# EasyEDA schematic SCH_Pcb Tof Robocup Joaquin_2023-06-20.json
TITLE: Sheet_1; REV: 1.0; Date: 2023-05-25; Sheet: 1/1; Drawn By: omglocura; Company: Your Company
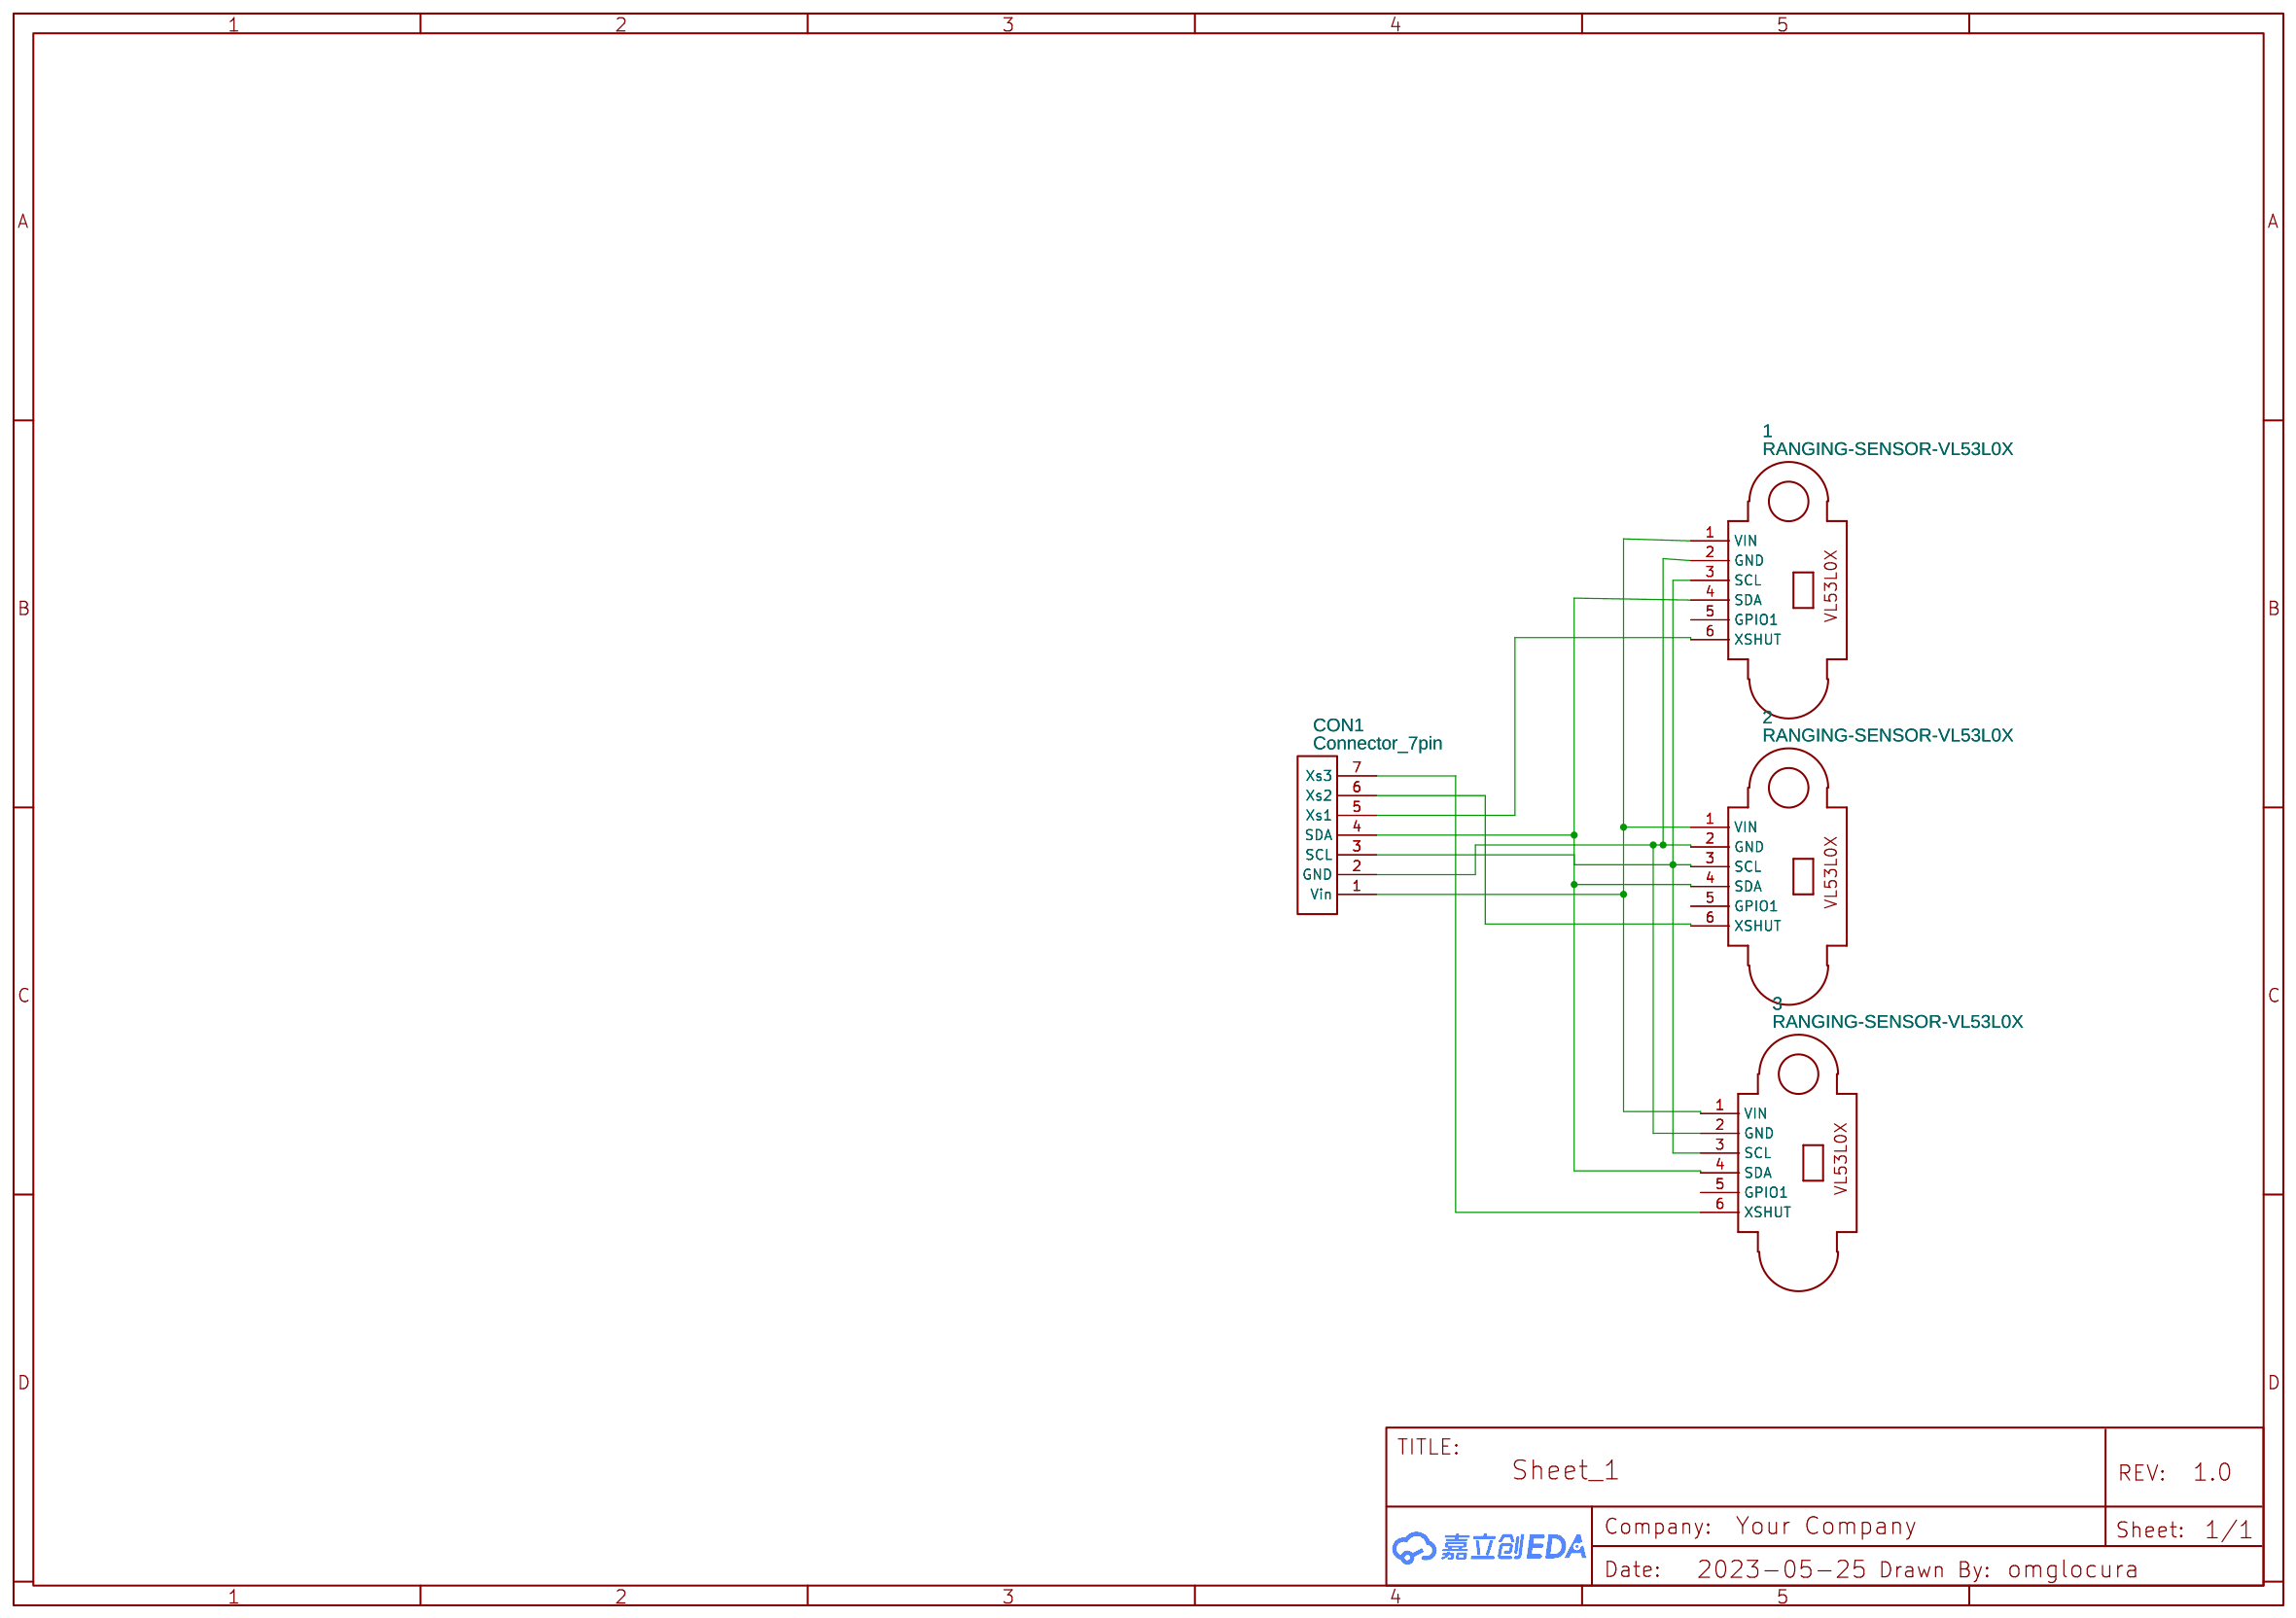
[diagram p0: schematic sheet]

## Parts
1  RANGING-SENSOR-VL53L0X  [RANGING-SENSOR-VL53L0X]
2  RANGING-SENSOR-VL53L0X  [RANGING-SENSOR-VL53L0X]
3  RANGING-SENSOR-VL53L0X  [RANGING-SENSOR-VL53L0X]
CON1  Connector_7pin  [CONNECTOR_7PIN]

## Library data of the parts
1-3 = RANGING-SENSOR-VL53L0X: Contributor: moung
CON1 = Connector_7pin: Contributor: panos

## Nets
Net-(1-1): 1.1(VIN) 2.1(VIN) 3.1(VIN) CON1.1(Vin)
Net-(1-2): 1.2(GND) 2.2(GND) 3.2(GND) CON1.2(GND)
Net-(1-3): 1.3(SCL) 2.3(SCL) 3.3(SCL) CON1.3(SCL)
Net-(1-4): 1.4(SDA) 2.4(SDA) 3.4(SDA) CON1.4(SDA)
Net-(1-6): 1.6(XSHUT) CON1.5(Xs1)
Net-(2-6): 2.6(XSHUT) CON1.6(Xs2)
Net-(3-6): 3.6(XSHUT) CON1.7(Xs3)

Not connected (* = marked no-connect by the designer): 1 5(GPIO1); 2 5(GPIO1); 3 5(GPIO1)
